# EAGLE design FT232-USB-LCD-backpack-1v1 (EAGLE 5.10)
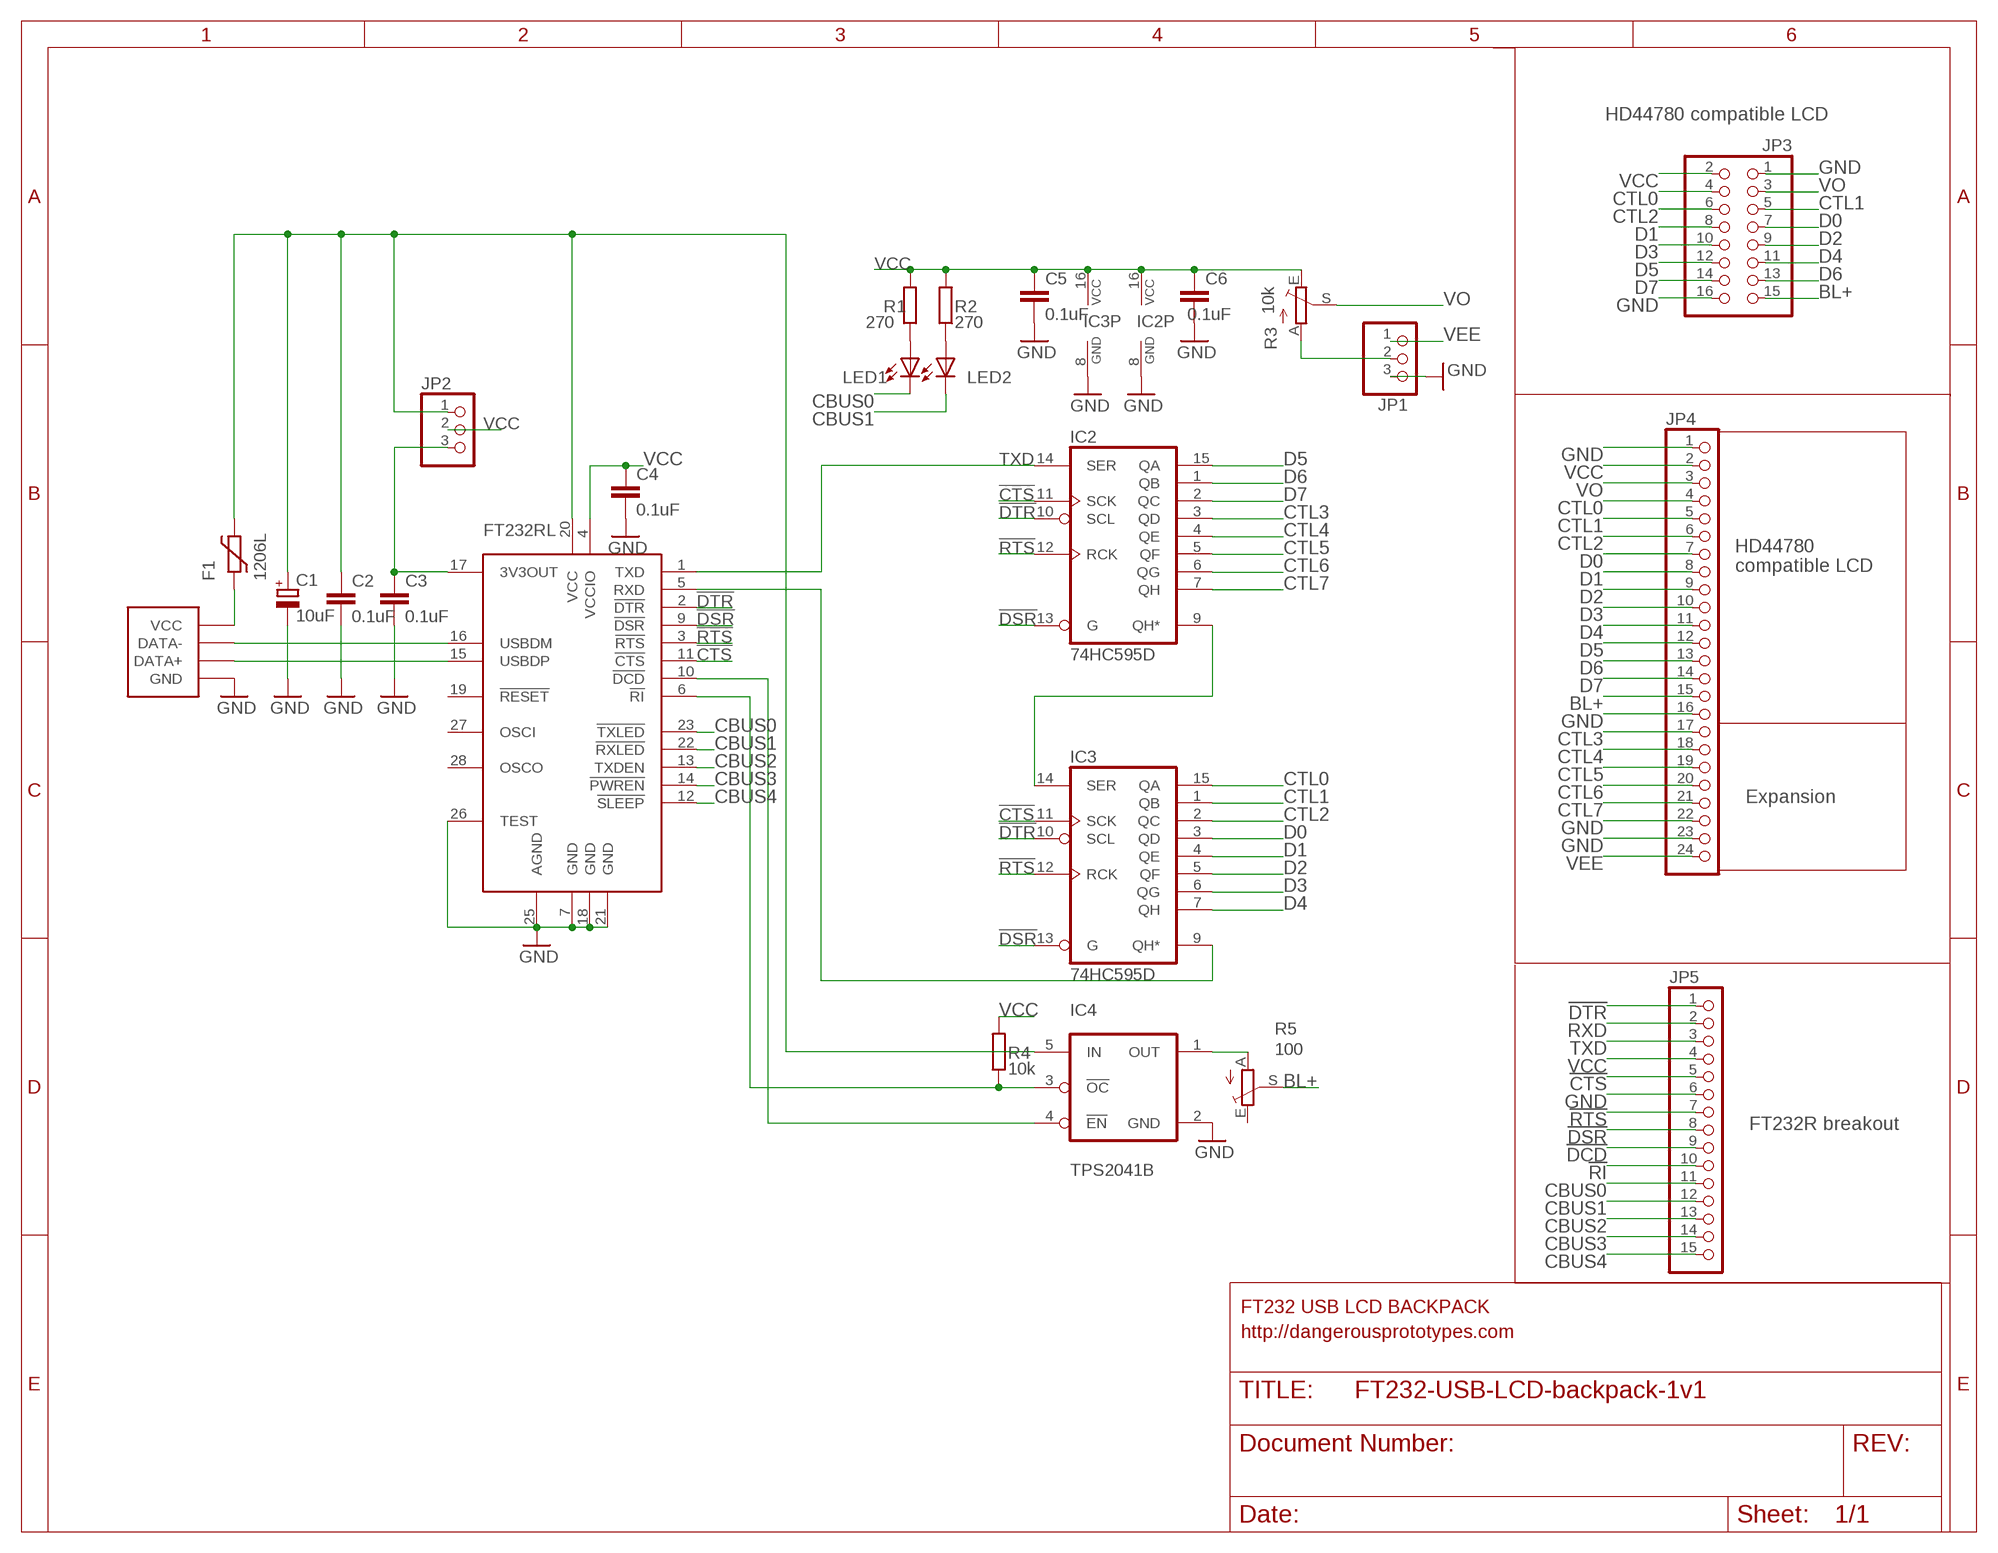
[diagram p0: schematic, sheet 1]

## Parts
C1  10uF  CAP_POLSMC_A  [SMC_A]
C2  0.1uF  C-EUC0603  [C0603]
C3  0.1uF  C-EUC0603  [C0603]
C4  0.1uF  C-EUC0603  [C0603]
C5  0.1uF  C-EUC0603  [C0603]
C6  0.1uF  C-EUC0603  [C0603]
F1  1206L  [1206L]
IC1  FT232RL  [SSOP28]
IC2  74HC595D  [SO16]
IC3  74HC595D  [SO16]
IC4  TPS2041B  [SOT-23-5]
JP1  PINHD-1X03_2.54-S  [1X03-S]
JP2  PINHD-1X03_2.54-S  [1X03-S]
JP3  PINHD-2X08_2.54  [2X08]
JP4  PINHD-1X24_2.54-S  [1X24-S]
JP5  PINHD-1X15_2.54-S  [1X15-S]
LED1  LEDCHIPLED_0805  [CHIPLED_0805]
LED2  LEDCHIPLED_0805  [CHIPLED_0805]
R1  270  R-EU_R0603  [R0603]
R2  270  R-EU_R0603  [R0603]
R3  10k  TRIM_EU-B25P  [B25P]
R4  10k  R-EU_R0603  [R0603]
R5  100  TRIM_EU-B25P  [B25P]
USB1  MINI-USBUSB1  [MINI-USBB]

## Nets
3.3V: C3.1 IC1.17(3V3OUT) JP2.3
5V: C1.+ C2.1 F1.P$2 IC1.20(VCC) IC4.5(IN) JP2.1
!CTS: IC1.11(!CTS) IC2.11(SCK) IC3.11(SCK) JP5.5
!DCD: IC1.10(!DCD) IC4.4(!EN) JP5.9
!DSR: IC1.9(!DSR) IC2.13(G) IC3.13(G) JP5.8
!DTR: IC1.2(!DTR) IC2.10(SCL) IC3.10(SCL) JP5.1
!RI: IC1.6(!RI) IC4.3(!OC) JP5.10 R4.1
!RTS: IC1.3(!RTS) IC2.12(RCK) IC3.12(RCK) JP5.7
BL+: JP3.15 JP4.15 R5.S
CBUS0: IC1.23(!TXLED) JP5.11 LED1.C
CBUS1: IC1.22(!RXLED) JP5.12 LED2.C
CBUS2: IC1.13(TXDEN) JP5.13
CBUS3: IC1.14(!PWREN) JP5.14
CBUS4: IC1.12(!SLEEP) JP5.15
CTL0: IC3.15(QA) JP3.4 JP4.4
CTL1: IC3.1(QB) JP3.5 JP4.5
CTL2: IC3.2(QC) JP3.6 JP4.6
CTL3: IC2.3(QD) JP4.17
CTL4: IC2.4(QE) JP4.18
CTL5: IC2.5(QF) JP4.19
CTL6: IC2.6(QG) JP4.20
CTL7: IC2.7(QH) JP4.21
D0: IC3.3(QD) JP3.7 JP4.7
D1: IC3.4(QE) JP3.8 JP4.8
D2: IC3.5(QF) JP3.9 JP4.9
D3: IC3.6(QG) JP3.10 JP4.10
D4: IC3.7(QH) JP3.11 JP4.11
D5: IC2.15(QA) JP3.12 JP4.12
D6: IC2.1(QB) JP3.13 JP4.13
D7: IC2.2(QC) JP3.14 JP4.14
GND: C1.- C2.2 C3.2 C4.2 C5.2 C6.2 IC1.7(GND) IC1.18(GND) IC1.21(GND) IC1.25(AGND) IC1.26(TEST) IC2.8(GND) IC3.8(GND) IC4.2(GND) JP1.3 JP3.1 JP3.16 JP4.1 JP4.16 JP4.22 JP4.23 JP5.6 USB1.5(GND)
N$1: IC1.15(USBDP) USB1.3(DATA+)
N$2: IC1.16(USBDM) USB1.2(DATA-)
N$3: F1.P$1 USB1.1(VCC)
N$6: LED1.A R1.1
N$8: IC2.9(QH*) IC3.14(SER)
N$15: LED2.A R2.1
N$17: JP1.2 R3.A
OUT: IC4.1(OUT) R5.A
RXD: IC1.5(RXD) IC3.9(QH*) JP5.2
TXD: IC1.1(TXD) IC2.14(SER) JP5.3
VCC: C4.1 C5.1 C6.1 IC1.4(VCCIO) IC2.16(VCC) IC3.16(VCC) JP2.2 JP3.2 JP4.2 JP5.4 R1.2 R2.2 R3.E R4.2
VEE: JP1.1 JP4.24
VO: JP3.3 JP4.3 R3.S
Unconnected: IC1.19(!RESET) IC1.27(OSCI) IC1.28(OSCO) R5.E

## Notes on the sheet
- HD44780 compatible LCD
- HD44780
- compatible LCD
- Expansion
- FT232R breakout
- FT232 USB LCD BACKPACK
- http://dangerousprototypes.com

## Library data of the parts
C1 = dp_devices:CAP_POL
C2-C6 = rcl:C-EU: CAPACITOR, European symbol
F1 = ptc-littlefuse:1206L
IC1 = dp_devices:FT232RL: USB to serial UART interface
IC2 IC3 = 74xx-eu:74*595: 8-bit SHIFT REGISTER, output latch
IC4 = dp_devices:TPS2041B: High side power distribution switch
JP1 JP2 = pinhead-2:PINHD-1X03: PIN HEADER
JP3 = pinhead-2:PINHD-2X08: PIN HEADER
JP4 = pinhead-2:PINHD-1X24: PIN HEADER
JP5 = pinhead-2:PINHD-1X15: PIN HEADER
LED1 LED2 = led:LED: LED OSRAM: - CHIPLED LG R971, LG N971, LY N971, LG Q971, LY Q971, LO R971, LY R971 LH N974, LH R974 LS Q976, LO Q976, LY Q976 LO Q996 - Hyper CHIPLED LW Q18S LB Q993, LB Q99A, LB R99A - SideLED LS A670, LO A670, LY A670, LG A670, LP A670 LB A673, LV A673, LT A673, LW A673 LH A674 LY A675 LS A676, LA A676, LO A676, LY A676, LW A676 LS A679, LY A679, LG A679 - Hyper Micro SIDELED® LS Y876, LA Y876, LO Y876, LY Y876 LT Y87S - SmartLED LW L88C, LW L88S LB L89C, LB L89S, LG L890 LS L89K, LO L89K, LY L89K LS L896, LA L896, LO L896, LY L896 - TOPLED LS T670, LO T670, LY T670, LG T670, LP T670 LSG T670, LSP T670, LSY T670, LOP T670, LYG T670 LG T671, LOG T671, LSG T671 LB T673, LV T673, LT T673, LW T673 LH T674 LS T676, LA T676, LO T676, LY T676, LB T676, LH T676, LSB T676, LW T676 LB T67C, LV T67C, LT T67C, LS T67K, LO T67K, LY T67K, LW E67C LS E67B, LA E67B, LO E67B, LY E67B, LB E67C, LV E67C, LT E67C LW T67C LS T679, LY T679, LG T679 LS T770, LO T770, LY T770, LG T770, LP T770 LB T773, LV T773, LT T773, LW T773 LH T774 LS E675, LA E675, LY E675, LS T675 LS T776, LA T776, LO T776, LY T776, LB T776 LHGB T686 LT T68C, LB T68C - Hyper Mini TOPLED® LB M676 - Mini TOPLED Santana® LG M470 LS M47K, LO M47K, LY M47K Source: http://www.osram.convergy.de LUXEON: - LUMILED® LXK2-PW12-R00, LXK2-PW12-S00, LXK2-PW14-U00, LXK2-PW14-V00 LXK2-PM12-R00, LXK2-PM12-S00, LXK2-PM14-U00 LXK2-PE12-Q00, LXK2-PE12-R00, LXK2-PE12-S00, LXK2-PE14-T00, LXK2-PE14-U00 LXK2-PB12-K00, LXK2-PB12-L00, LXK2-PB12-M00, LXK2-PB14-N00, LXK2-PB14-P00, LXK2-PB14-Q00 LXK2-PR12-L00, LXK2-PR12-M00, LXK2-PR14-Q00, LXK2-PR14-R00 LXK2-PD12-Q00, LXK2-PD12-R00, LXK2-PD12-S00 LXK2-PH12-R00, LXK2-PH12-S00 LXK2-PL12-P00, LXK2-PL12-Q00, LXK2-PL12-R00 Source: www.luxeon.com KINGBRIGHT: KA-3528ASYC Source: www.kingbright.com
R1 R2 R4 = rcl:R-EU_: RESISTOR, European symbol
R3 R5 = pot:TRIM_EU-: POTENTIOMETER
USB1 = dp_devices:MINI-USB

## Board
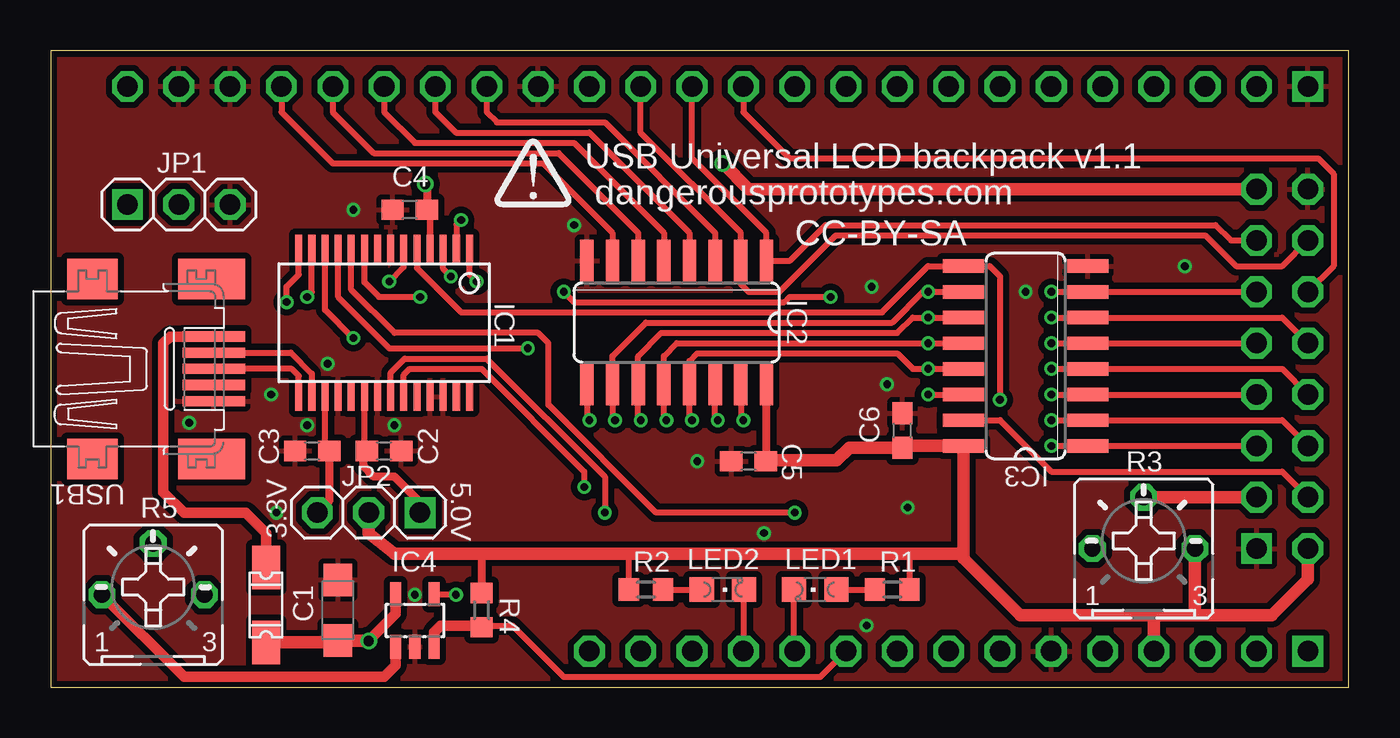
[diagram p1: board, top side]
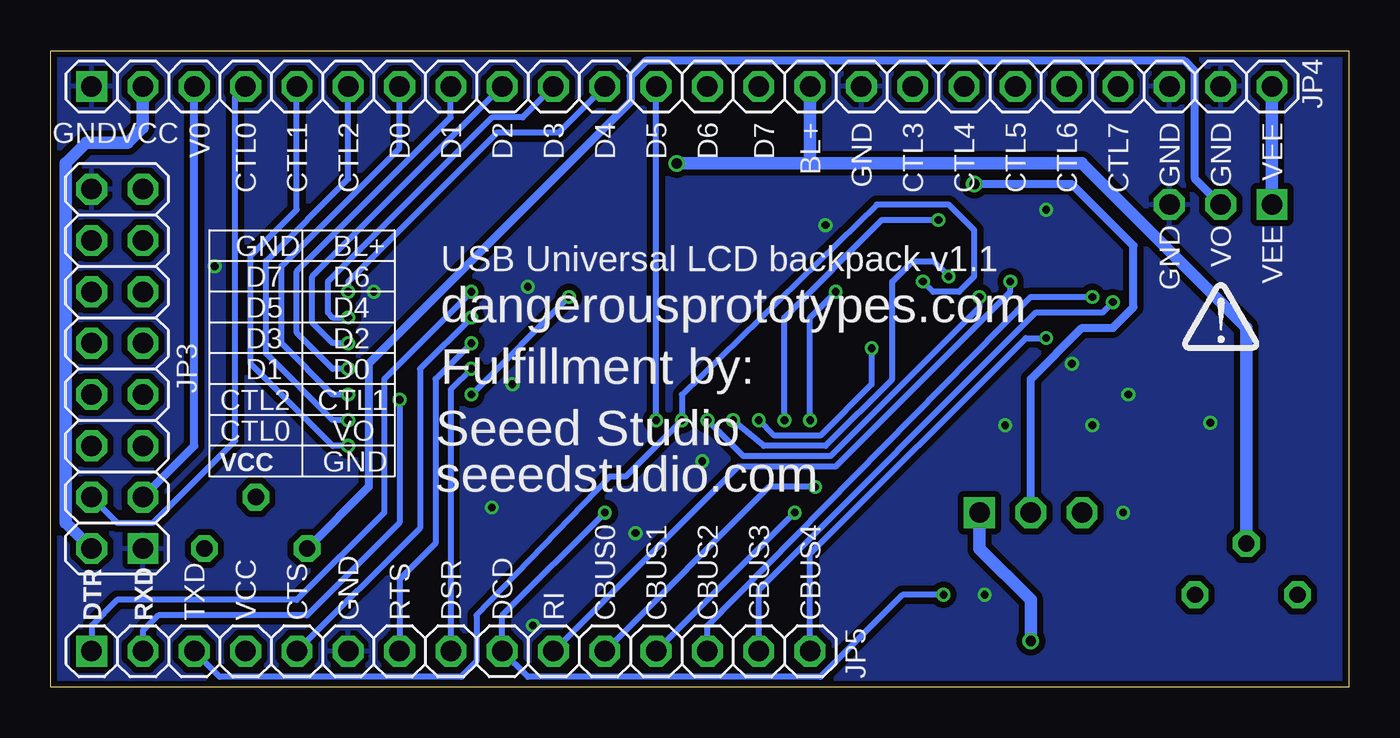
[diagram p2: board, bottom side, seen from below]

Size 64.26 x 31.5 mm. Coordinates in mm from the lower left corner, seen from the top.
Outline: 0,0 64.26,0 64.26,31.5 0,31.5 0,0
Copper layers (1*16): Top 0.035mm / dielectric 1.5mm / Bottom 0.035mm
Design rules "Fusion_eagle_rule_v1.1": minimum track width 6mil, minimum drill 12mil, track to track 6mil, track to pad 6mil, pad to pad 6mil, via to via 6mil, smd to smd 0mil, copper to edge 10mil, drill to drill 10mil, minimum pad ring 10mil, minimum via ring 6mil, stop-mask expansion 2mil, vias tented up to drill 100mil, thermal gap 10mil

### Footprints (pad centres in the part's own frame; a part is rotated, then mirrored left to right if it is on the bottom)
SMC_A = smd 1.6 x 1.4: + -1.5,0; - 1.5,0
C0603 = smd 1.1 x 1: 1 -0.85,0; 2 0.85,0
1206L = smd 2.16 x 1.4: P$1 -1.85,0; P$2 1.85,0
SSOP28 = smd 0.348 x 1.397: 1 -4.225,-3.656; 2 -3.575,-3.656; 3 -2.925,-3.656; 4 -2.275,-3.656; 5 -1.625,-3.656; 6 -0.975,-3.656; 7 -0.325,-3.656; 8 0.325,-3.656; 9 0.975,-3.656; 10 1.625,-3.656; 11 2.275,-3.656; 12 2.925,-3.656; 13 3.575,-3.656; 14 4.225,-3.656; 15 4.225,3.656; 16 3.575,3.656; 17 2.925,3.656; 18 2.275,3.656; 19 1.625,3.656; 20 0.975,3.656; 21 0.325,3.656; 22 -0.325,3.656; 23 -0.975,3.656; 24 -1.625,3.656; 25 -2.275,3.656; 26 -2.925,3.656; 27 -3.575,3.656; 28 -4.225,3.656
SO16 = smd 0.66 x 2.032: 1 -4.445,-3.073; 2 -3.175,-3.073; 3 -1.905,-3.073; 4 -0.635,-3.073; 5 0.635,-3.073; 6 1.905,-3.073; 7 3.175,-3.073; 8 4.445,-3.073; 9 4.445,3.073; 10 3.175,3.073; 11 1.905,3.073; 12 0.635,3.073; 13 -0.635,3.073; 14 -1.905,3.073; 15 -3.175,3.073; 16 -4.445,3.073
SOT-23-5 = smd 0.55 x 1.2: 1 -0.95,-1.3; 2 0,-1.3; 3 0.95,-1.3; 4 0.95,1.3; 5 -0.95,1.3
1X03-S = drill 1.016 square: 1 -2.54,0 | drill 1.016 octagon: 2 0,0; 3 2.54,0
2X08 = drill 1.016 square: 1 -8.89,-1.27 | drill 1.016 octagon: 2 -8.89,1.27; 3 -6.35,-1.27; 4 -6.35,1.27; 5 -3.81,-1.27; 6 -3.81,1.27; 7 -1.27,-1.27; 8 -1.27,1.27; 9 1.27,-1.27; 10 1.27,1.27; 11 3.81,-1.27; 12 3.81,1.27; 13 6.35,-1.27; 14 6.35,1.27; 15 8.89,-1.27; 16 8.89,1.27
1X24-S = drill 1.016 square: 1 -29.21,0 | drill 1.016 octagon: 2 -26.67,0; 3 -24.13,0; 4 -21.59,0; 5 -19.05,0; 6 -16.51,0; 7 -13.97,0; 8 -11.43,0; 9 -8.89,0; 10 -6.35,0; 11 -3.81,0; 12 -1.27,0; 13 1.27,0; 14 3.81,0; 15 6.35,0; 16 8.89,0; 17 11.43,0; 18 13.97,0; 19 16.51,0; 20 19.05,0; 21 21.59,0; 22 24.13,0; 23 26.67,0; 24 29.21,0
1X15-S = drill 1.016 square: 1 -17.78,0 | drill 1.016 octagon: 2 -15.24,0; 3 -12.7,0; 4 -10.16,0; 5 -7.62,0; 6 -5.08,0; 7 -2.54,0; 8 0,0; 9 2.54,0; 10 5.08,0; 11 7.62,0; 12 10.16,0; 13 12.7,0; 14 15.24,0; 15 17.78,0
CHIPLED_0805 = smd 1.2 x 1.2: A 0,-1.05; C 0,1.05
R0603 = smd 1 x 1.1: 1 -0.85,0; 2 0.85,0
B25P = drill 0.813 octagon: A -2.54,0; E 2.54,0; S 0,2.54
MINI-USBB = smd 3.1 x 0.5: 1 3,1.6; 2 3,0.8; 3 3,0; 4 3,-0.8; 5 3,-1.6 | smd 2.5 x 2: M1 -3,-4.45; M2 -3,4.45 | smd 3.3 x 2: M3 2.9,4.45; M4 2.9,-4.45

### Placement (x,y rotation side)
C1  14.22,3.81 90 top
C2  16.51,11.68 0 top
C3  12.95,11.68 180 top
C4  17.78,23.62 180 top
C5  34.54,11.18 180 top
C6  42.16,12.7 90 top
F1  10.67,4.06 270 top
IC1  16.51,18.03 180 top
IC2  30.99,18.03 180 top
IC3  48.26,16.38 90 top
IC4  18.03,3.3 0 top
JP1  6.35,23.88 0 top
JP2  15.75,8.64 180 top
JP3  60.96,15.75 90 bottom
JP4  33.02,29.72 0 bottom
JP5  44.45,1.78 0 bottom
LED1  37.85,4.83 90 top
LED2  33.27,4.83 270 top
R1  41.66,4.83 0 top
R2  29.46,4.83 180 top
R3  54.1,6.86 0 top
R4  21.34,3.81 90 top
R5  5.08,4.57 0 top
U$1  [DP_LOGO]  23.88,24.38 0 top
U$2  [DP_LOGO]  6.35,17.27 0 bottom
USB1  5.08,15.75 0 top

### Tracks (layer width: path | path; a pad name or v marks a point on that pad's centre or on a via)
3.3V
  Top 0.305: IC1.17 13.59,11.9 C3.1
  Top 0.406: C3.1 13.8,9.23 JP2.3
5V  (via drill 0.51)
  Top 0.305: IC1.20 15.54,11.55 C2.1
  Top 0.406: C2.1 15.75,11.43 | C2.1 15.75,11.6 | JP2.1 18.29,9.14 17.02,10.41 16,10.41 15.49,10.92 15.49,11.52 C2.1
  Top 0.508: C1.+ 14.25,2.29 | IC4.5 17.08,3.62 v15.75,2.29
  Top 0.61: F1.P$2 14.13,2.21 C1.+ | 14.25,2.29 v15.75,2.29
  Bottom 0.61: JP2.1 18.29,6.86 15.75,4.32 v15.75,2.29
!CTS  (via drill 0.38)
  Top 0.305: IC3.11 v43.43,18.29 42.67,18.29 41.91,17.53 30.23,17.53 29.08,16.38 IC2.11 29.08,13.34 v29.21,13.21 | IC1.11 14.23,19.29 16.76,16.76 v23.62,16.76
  Bottom 0.305: v43.43,18.29 45.97,15.75 45.97,7.87 JP5.5 | v29.21,13.21 28.45,12.45 26.16,12.45 23.62,14.99 v23.62,16.76
!DCD  (via drill 0.38)
  Top 0.305: IC1.10 14.88,19.66 17.02,17.53 24.13,17.53 24.64,17.02 24.64,13.97 29.97,8.64 v36.83,8.64 | IC4.4 19.78,4.6 v20.07,4.57
  Bottom 0.305: v36.83,8.64 41.91,3.56 JP5.9 40.64,0.51 26.16,0.51 22.1,4.57 v20.07,4.57
!DSR  (via drill 0.38)
  Top 0.305: IC3.13 v43.43,15.75 42.67,15.75 41.91,16.51 32,16.51 31.62,16.13 IC2.13 31.62,13.34 v31.75,13.21 | IC1.9 15.54,20.02 16.26,19.3 v18.29,19.3
  Bottom 0.305: JP5.8 44.45,14.73 v43.43,15.75 | v31.75,13.21 29.97,11.43 25.65,11.43 18.29,18.8 v18.29,19.3
!DTR  (via drill 0.38)
  Top 0.305: IC3.10 v43.43,19.56 43.18,19.56 41.66,18.03 29.46,18.03 27.81,16.38 IC2.10 27.81,13.34 v27.94,13.21 | IC1.2 20.09,22.88 v20.32,23.11
  Bottom 0.305: JP5.1 62.23,3.05 60.96,4.32 52.07,4.32 47.75,8.64 47.75,15.24 v43.43,19.56 | v20.32,23.11 23.11,23.11 27.94,18.29 v27.94,13.21
!RI  (via drill 0.38)
  Top 0.305: IC1.6 17.48,20.79 v16.76,20.07 | 21.25,3.05 22.86,3.05 25.4,0.51 38.1,0.51 JP5.10
  Top 0.508: IC4.3 18.98,2.73 19.3,3.05 21.25,3.05 R4.1
  Bottom 0.305: v16.76,20.07 16.76,19.56 25.4,10.92 30.23,10.92 JP5.10
!RTS  (via drill 0.38)
  Top 0.305: IC3.12 v43.43,17.02 30.99,17.02 30.35,16.38 IC2.12 30.35,13.34 v30.48,13.21 | IC1.3 19.43,20.7 v19.81,20.32
  Bottom 0.305: v43.43,17.02 45.21,15.24 45.21,7.11 46.99,5.33 JP5.7 | v19.81,20.32 20.57,21.08 21.59,21.08 22.61,20.07 22.61,15.24 25.91,11.94 28.96,11.94 v30.48,13.21
BL+  (via drill 0.51)
  Top 0.61: JP3.15 34.54,24.64 v33.27,25.91
  Bottom 0.61: R5.S 5.08,17.78 13.21,25.91 26.67,25.91 | 26.67,25.91 v33.27,25.91 | 26.67,25.91 JP4.15
CBUS0  (via drill 0.38)
  Top 0.305: IC1.23 17.48,15.45 17.78,15.75 21.34,15.75 26.42,10.67 v26.42,9.91 | LED1.C 36.8,1.81 JP5.11
  Bottom 0.305: v26.42,9.91 28.7,9.91 JP5.11
CBUS1  (via drill 0.38)
  Top 0.305: IC1.22 16.84,15.56 17.53,16.26 21.59,16.26 27.43,10.41 v27.43,8.64 | LED2.C 34.32,1.81 JP5.12
  Bottom 0.305: v27.43,8.64 JP5.12
CBUS2  (via drill 0.38)
  Top 0.305: IC1.13 12.94,19.54 v12.7,19.3
  Bottom 0.305: JP5.13 31.75,3.05 15.75,19.3 v12.7,19.3
CBUS3  (via drill 0.38)
  Top 0.305: IC1.14 12.29,20.41 11.68,19.81 v11.68,19.05
  Bottom 0.305: v11.68,19.05 12.19,18.54 15.49,18.54 29.21,4.83 JP5.14
CBUS4  (via drill 0.38)
  Top 0.305: IC1.12 13.59,18.66 v14.99,17.27
  Bottom 0.305: JP5.15 26.67,6.6 16,17.27 v14.99,17.27
CTL0
  Top 0.305: IC3.15 46.99,13.21 49.53,10.67 60.96,10.67 JP3.4
  Bottom 0.305: JP3.4 60.96,8.13 59.18,8.13 55.12,12.19 55.12,29.21 JP4.4
CTL1  (via drill 0.38)
  Top 0.305: JP3.5 IC3.1 v49.53,11.94
  Bottom 0.305: JP4.5 52.07,23.62 54.36,21.34 54.36,16 50.29,11.94 v49.53,11.94
CTL2  (via drill 0.38)
  Top 0.305: JP3.6 60.96,13.21 IC3.2 v49.53,13.21
  Bottom 0.305: v49.53,13.21 50.29,13.21 53.59,16.51 53.59,21.08 49.53,25.15 JP4.6
CTL3
  Top 0.305: IC2.3 32.89,22.48 27.43,27.94 22.1,27.94 21.59,28.45 JP4.17
CTL4
  Top 0.305: IC2.4 31.62,22.48 26.67,27.43 20.07,27.43 19.05,28.45 JP4.18
CTL5
  Top 0.305: JP4.19 16.51,28.45 18.03,26.92 25.91,26.92 30.35,22.48 IC2.5
CTL6
  Top 0.305: JP4.20 13.97,28.45 16,26.42 25.15,26.42 29.08,22.48 IC2.6
CTL7
  Top 0.305: IC2.7 27.81,22.48 24.38,25.91 13.97,25.91 11.43,28.45 JP4.21
D0  (via drill 0.38)
  Top 0.305: JP3.7 IC3.3 v49.53,14.48
  Bottom 0.305: v49.53,14.48 50.29,14.48 52.83,17.02 52.83,20.83 46.99,26.67 JP4.7
D1  (via drill 0.38)
  Top 0.305: JP3.8 60.96,15.75 IC3.4 v49.53,15.75
  Bottom 0.305: v49.53,15.75 50.29,15.75 52.07,17.53 52.07,20.57 44.45,28.19 JP4.8
D2  (via drill 0.38)
  Top 0.305: JP3.9 IC3.5 v49.53,17.02
  Bottom 0.305: v49.53,17.02 50.29,17.02 51.31,18.03 51.31,20.32 JP4.9
D3  (via drill 0.38)
  Top 0.305: JP3.10 60.96,18.29 IC3.6 v49.53,18.29
  Bottom 0.305: v49.53,18.29 50.29,18.29 50.55,18.54 50.55,20.07 42.42,28.19 40.89,28.19 JP4.10
D4  (via drill 0.38)
  Top 0.305: JP3.11 IC3.7 v49.53,19.56
  Bottom 0.305: JP4.11 39.12,27.43 42.16,27.43 49.53,20.07 v49.53,19.56
D5  (via drill 0.38)
  Top 0.305: IC2.15 34.16,13.08 v34.29,13.21 | JP3.12 63.5,20.83 63.5,25.4 62.74,26.16 36.58,26.16 34.29,28.45 JP4.12
  Bottom 0.305: v34.29,13.21 JP4.12
D6
  Top 0.305: JP4.13 31.75,26.16 35.43,22.48 IC2.1 36.6,21.11 38.35,22.86 57.66,22.86 58.42,22.1 JP3.13
D7
  Top 0.305: JP4.14 29.21,27.43 34.16,22.48 IC2.2 34.16,19.94 34.54,19.56 36.07,19.56 38.86,22.35 57.15,22.35 58.67,20.83 60.96,20.83 JP3.14
GND  (via drill 0.38)
  other vias: 48.26,19.56 56.13,20.83 25.91,22.86 41.4,14.99 32,11.18 17.02,12.95 13.72,16 11.18,8.64 10.92,14.48 6.86,13.08 12.7,12.95 40.64,19.81 35.31,7.62 18.03,4.57 14.99,23.62 40.39,3.05 42.42,8.89
  pour Top (isolate 0.305): 0,31.5 0,0 64.26,0 64.26,31.5
  pour Bottom (isolate 0.305): 0,31.5 0,0 64.26,0 64.26,31.5
N$1
  Top 0.305: IC1.15 12.29,15.4 11.94,15.75 USB1.3
N$2
  Top 0.305: IC1.16 12.94,15.51 11.9,16.55 USB1.2
N$3
  Top 0.508: USB1.1 5.92,17.35 5.59,17.02 5.59,9.65 6.6,8.64 9.65,8.64 10.67,7.62 F1.P$1
N$6
  Top 0.305: LED1.A R1.1
N$8  (via drill 0.38)
  Top 0.305: IC2.9 26.54,13.34 v26.67,13.21 | v43.43,14.48 IC3.14 | v38.61,19.3 36.58,19.3 36.32,19.05 25.91,19.05 v25.4,19.56
  Bottom 0.305: v38.61,19.3 v43.43,14.48 | v25.4,19.56 26.67,18.29 v26.67,13.21
N$15
  Top 0.305: R2.1 LED2.A
N$17
  Bottom 0.406: R3.A 48.51,9.91 48.51,16 35.56,28.96 35.56,30.23 34.8,30.99 8.13,30.99 7.62,30.48 7.62,25.15 JP1.2
OUT
  Top 0.508: IC4.1 17.08,1.08 16.51,0.51 6.6,0.51 R5.A
RXD  (via drill 0.38)
  Top 0.305: v46.99,14.22 46.99,20.32 46.48,20.83 IC3.9 43.43,20.83 41.15,18.54 20.32,18.54 18.14,20.73 IC1.5
  Bottom 0.305: v46.99,14.22 46.99,8.13 51.56,3.56 58.93,3.56 59.69,2.79 JP5.2
TXD  (via drill 0.38)
  Top 0.305: IC2.14 32.89,13.08 v33.02,13.21 | IC1.1 20.73,20.41 v21.08,20.07
  Bottom 0.305: v21.08,20.07 20.57,19.56 19.3,19.56 18.54,20.32 18.54,22.61 19.81,23.88 23.37,23.88 33.02,14.48 v33.02,13.21 35.81,10.41 36.58,10.41 43.18,3.56 43.18,1.27 43.94,0.51 55.88,0.51 JP5.3
VCC  (via drill 0.51)
  Top 0.305: R2.2 28.61,6.44 28.45,6.6 | R1.2 42.51,6.52 42.42,6.6
  Top 0.33: IC1.4 18.79,23.47 C4.1
  Top 0.406: IC2.16 35.43,11.21 C5.1 | 42.25,11.94 C6.1 | 21.34,6.6 R4.2 | C4.1 18.63,24.8 v18.54,24.89
  Top 0.61: 42.25,11.94 IC3.16 45.19,6.6 | 35.43,11.21 38.9,11.21 39.54,11.85 C6.1 | 54.61,3.56 JP5.4 | JP3.2 62.23,5.33 60.45,3.56 56.64,3.56 | 54.61,3.56 48.01,3.56 45.19,6.38 45.19,6.6 | 54.61,3.56 56.64,3.56 | 56.64,3.56 R3.E | JP2.2 15.75,7.62 17.02,6.6 21.34,6.6 28.45,6.6 42.42,6.6 45.19,6.6
  Bottom 0.406: JP2.2 15.75,15.24 13.21,17.78 11.68,17.78 10.67,18.8 10.67,21.84 13.72,24.89 v18.54,24.89
  Bottom 0.61: JP4.2 59.69,27.69 60.45,26.92 62.48,26.92 63.5,25.91 63.5,8.13 JP3.2
VEE
  Bottom 0.61: JP1.1 JP4.24
VO
  Top 0.61: R3.S JP3.3
  Bottom 0.406: JP4.3 57.15,11.94 JP3.3

### Text on the board
tNames: USB Universal LCD backpack v1.1 | dangerousprototypes.com | CC-BY-SA | 5.0V | 3.3V
bNames: VEE | GND | GND | CTL7 | CTL6 | CTL5 | CTL4 | CTL3 | GND | BL+ | D7 | D6 | D5 | D4 | D3 | D2 | D1 | D0 | CTL2 | CTL1 | CTL0 | V0 | VCC | GND | VEE | VO | GND | USB Universal LCD backpack v1.1 | BL+ | GND | D6 | D7 | dangerousprototypes.com | D4 | D5 | D2 | D3 | Fulfillment by: | D0 | D1 | CTL1 | CTL2 | Seeed Studio | VO | CTL0 | GND | VCC | seeedstudio.com | CBUS4 | CBUS3 | CBUS2 | CBUS1 | CBUS0 | RI | DCD | DSR | RTS | GND | CTS | VCC | TXD | RXD | DTR